# EAGLE schematic SIHMTEST (EAGLE 7.6.0)
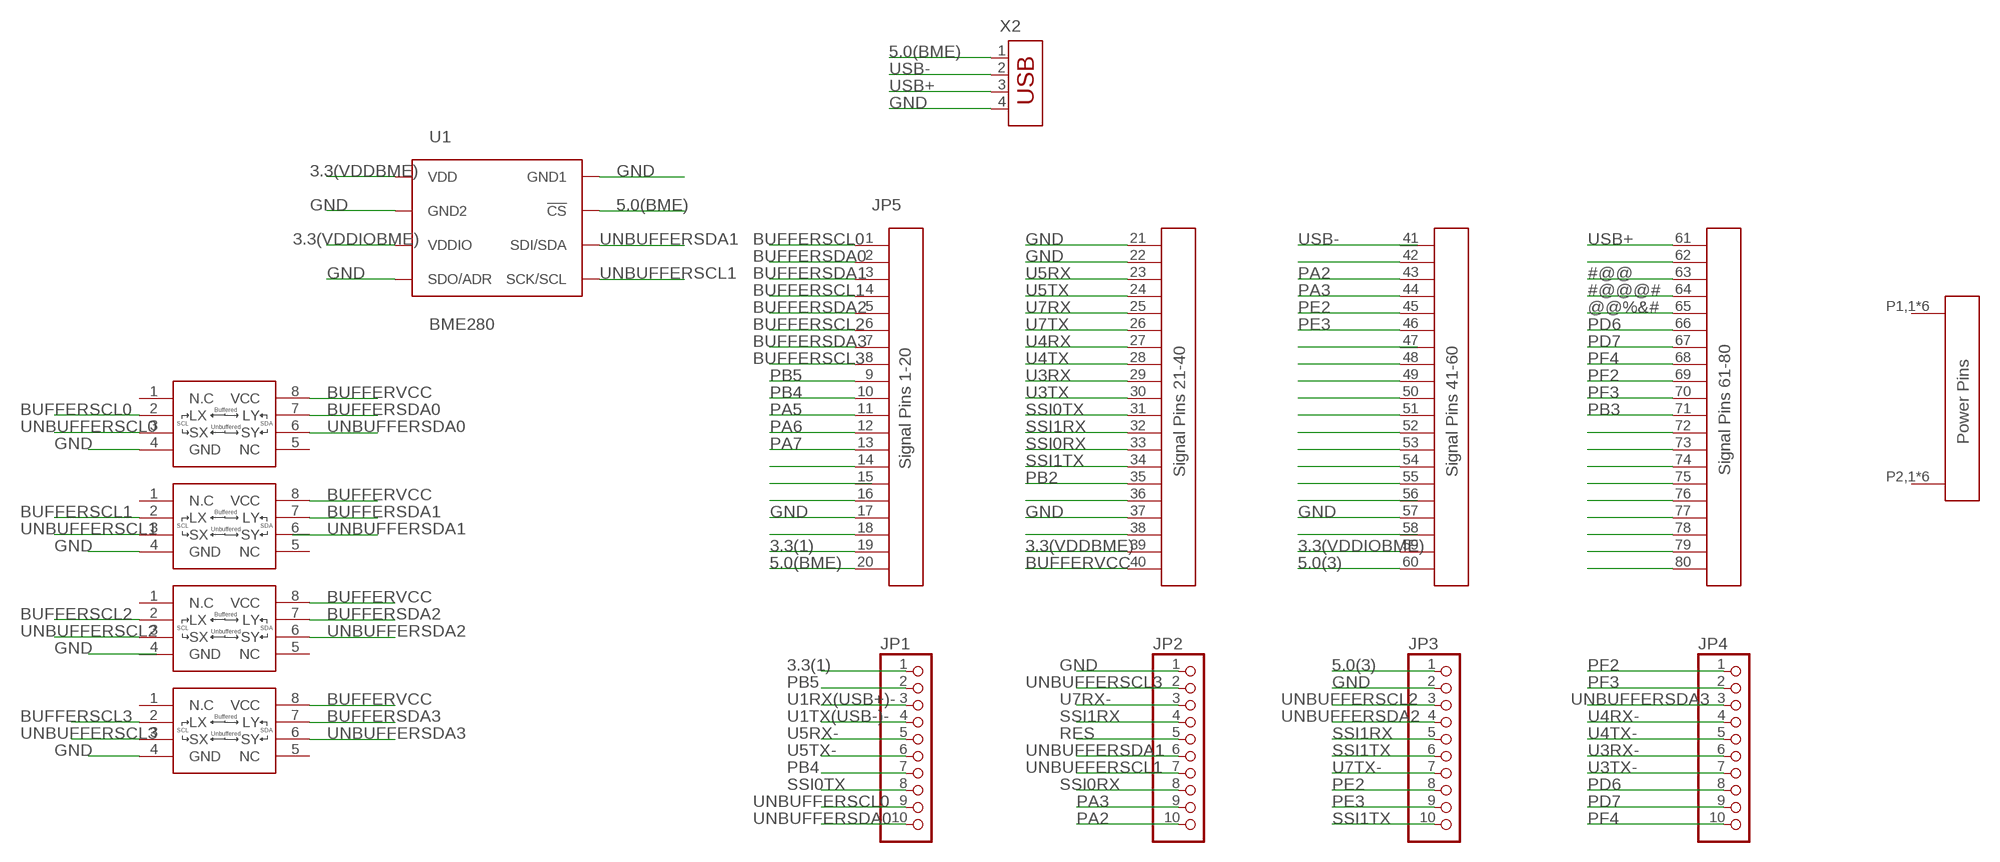
[diagram p0: schematic, sheet 1]

## Parts
JP1  PINHD-1X10/90  [1X10/90]
JP2  PINHD-1X10/90  [1X10/90]
JP3  PINHD-1X10/90  [1X10/90]
JP4  PINHD-1X10/90  [1X10/90]
JP5  MPSC-01-80MPSC-RA-LC  [MPSC-01-80]
U1  BME280  [BME280_LGA]
U$1  P82B715  [SO8]
U$2  P82B715  [SO8]
U$3  P82B715  [SO8]
U$4  P82B715  [SO8]
X2  USB-787616  [USB]

## Nets
3.3(1): JP1.1 JP5.19
3.3(VDDBME): JP5.39 U1.P$8(VDD)
3.3(VDDIOBME): JP5.59 U1.P$6(VDDIO)
5.0(3): JP3.1 JP5.60
5.0(BME): JP5.20 U1.P$2(!CS) X2.1
#@@: JP5.63
#@@@#: JP5.64
@@%&#: JP5.65
BUFFERSCL0: JP5.1 U$1.2(LX)
BUFFERSCL1: JP5.4 U$2.2(LX)
BUFFERSCL2: JP5.6 U$3.2(LX)
BUFFERSCL3: JP5.8 U$4.2(LX)
BUFFERSDA0: JP5.2 U$1.7(LY)
BUFFERSDA1: JP5.3 U$2.7(LY)
BUFFERSDA2: JP5.5 U$3.7(LY)
BUFFERSDA3: JP5.7 U$4.7(LY)
BUFFERVCC: JP5.40 U$1.8(VCC) U$2.8(VCC) U$3.8(VCC) U$4.8(VCC)
GND: JP2.1 JP3.2 JP5.17 JP5.21 JP5.22 JP5.37 JP5.57 JP5.77 U1.P$1(GND1) U1.P$5(SDO/ADR) U1.P$7(GND2) U$1.4(GND) U$2.4(GND) U$4.4(GND) X2.4
N$2: JP5.42
N$3: JP5.62
N$14: JP5.48
N$15: JP5.49
N$16: JP5.50
N$17: JP5.51
N$18: JP5.52
N$19: JP5.53
N$20: JP5.54
N$21: JP5.55
N$22: JP5.36
N$24: JP5.14
N$26: JP5.16
N$28: JP5.18
N$29: JP5.38
N$41: JP5.72
N$42: JP5.73
N$43: JP5.74
N$44: JP5.75
N$45: JP5.76
N$47: JP5.78
N$48: JP5.79
N$49: JP5.80
PA2: JP2.10 JP5.43
PA3: JP2.9 JP5.44
PA5: JP5.11
PA6: JP5.12
PA7: JP5.13
PB2: JP5.35
PB3: JP5.71
PB4: JP1.7 JP5.10
PB5: JP1.2 JP5.9
PD6: JP4.8 JP5.66
PD7: JP4.9 JP5.67
PE2: JP3.8 JP5.45
PE3: JP3.9 JP5.46
PF2: JP4.1 JP5.69
PF3: JP4.2 JP5.70
PF4: JP4.10 JP5.68
RES: JP2.5
SSI0RX: JP2.8 JP5.33
SSI0TX: JP1.8 JP5.31
SSI1RX: JP2.4 JP3.5 JP5.32
SSI1TX: JP3.6 JP3.10 JP5.34
U1RX(USB+)-: JP1.3
U1TX(USB-)-: JP1.4
U3RX: JP5.29
U3RX-: JP4.6
U3TX: JP5.30
U3TX-: JP4.7
U4RX: JP5.27
U4RX-: JP4.4
U4TX: JP5.28
U4TX-: JP4.5
U5RX: JP5.23
U5RX-: JP1.5
U5TX: JP5.24
U5TX-: JP1.6
U7RX: JP5.25
U7RX-: JP2.3
U7TX: JP5.26
U7TX-: JP3.7
UNBUFFERSCL0: JP1.9 U$1.3(SX)
UNBUFFERSCL1: JP2.7 U1.P$4(SCK/SCL) U$2.3(SX)
UNBUFFERSCL2: JP3.3 U$3.3(SX)
UNBUFFERSCL3: JP2.2 U$4.3(SX)
UNBUFFERSDA0: JP1.10 U$1.6(SY)
UNBUFFERSDA1: JP2.6 U1.P$3(SDI/SDA)
UNBUFFERSDA2: JP3.4 U$3.6(SY)
UNBUFFERSDA3: JP4.3 U$4.6(SY)
USB+: JP5.61 X2.3
USB-: X2.2
Unconnected: JP5.15 JP5.41 JP5.47 JP5.56 JP5.58 JP5.P1,1(POWER1) JP5.P1,2(POWER1) JP5.P1,3(POWER1) JP5.P1,4(POWER1) JP5.P1,5(POWER1) JP5.P1,6(POWER1) JP5.P2,1(POWER2) JP5.P2,2(POWER2) JP5.P2,3(POWER2) JP5.P2,4(POWER2) JP5.P2,5(POWER2) JP5.P2,6(POWER2) U$1.1(N.C) U$1.5(NC) U$2.1(N.C) U$2.5(NC) U$2.6(SY) U$3.1(N.C) U$3.4(GND) U$3.5(NC) U$4.1(N.C) U$4.5(NC)

## Library data of the parts
JP1-JP4 = pinhead:PINHD-1X10: PIN HEADER
JP5 = samtec:MPSC-01-80
U1 = BME280ComponentLibrary:BME280; PROD_ID: IC-13090
U$1-U$4 = NXP:P82B715
X2 = con-amp:USB-787616: AMP connector